# Altium project hub.PrjPCB
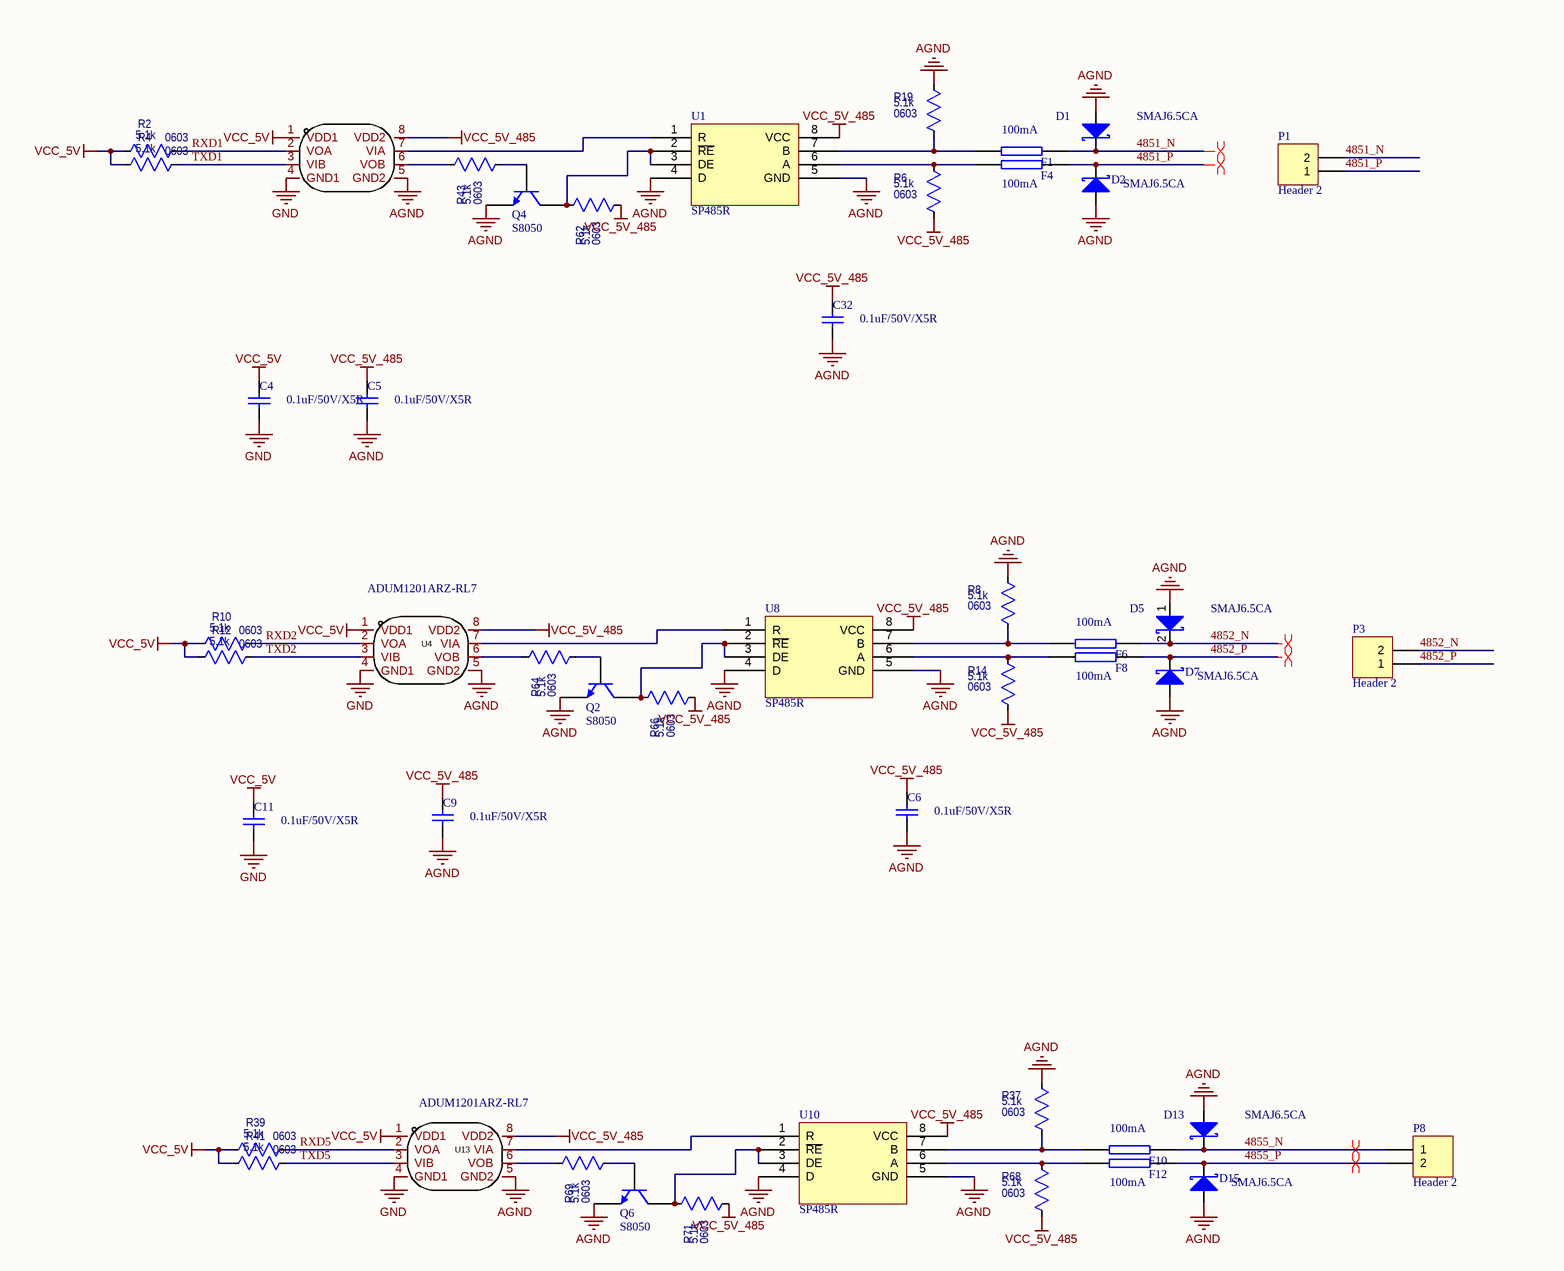
[diagram p0: rs485.SchDoc, top left]
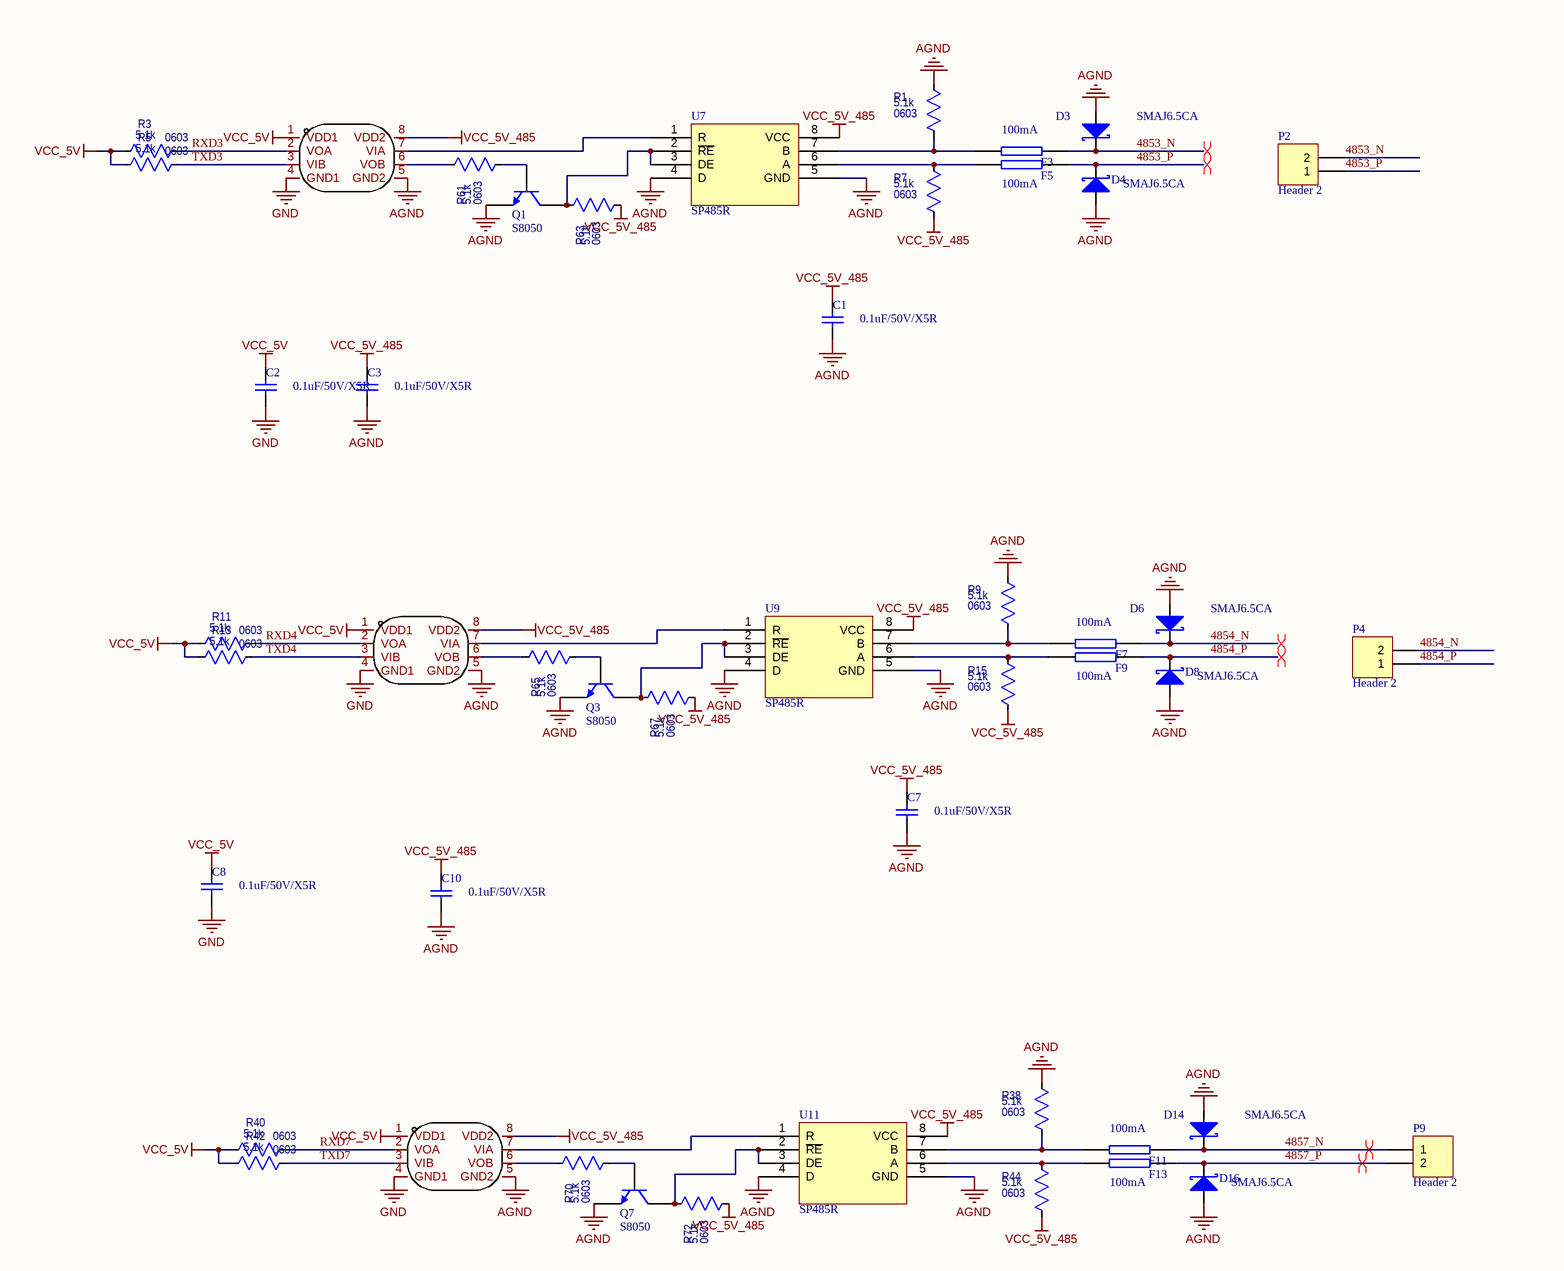
[diagram p1: rs485.SchDoc, top right]
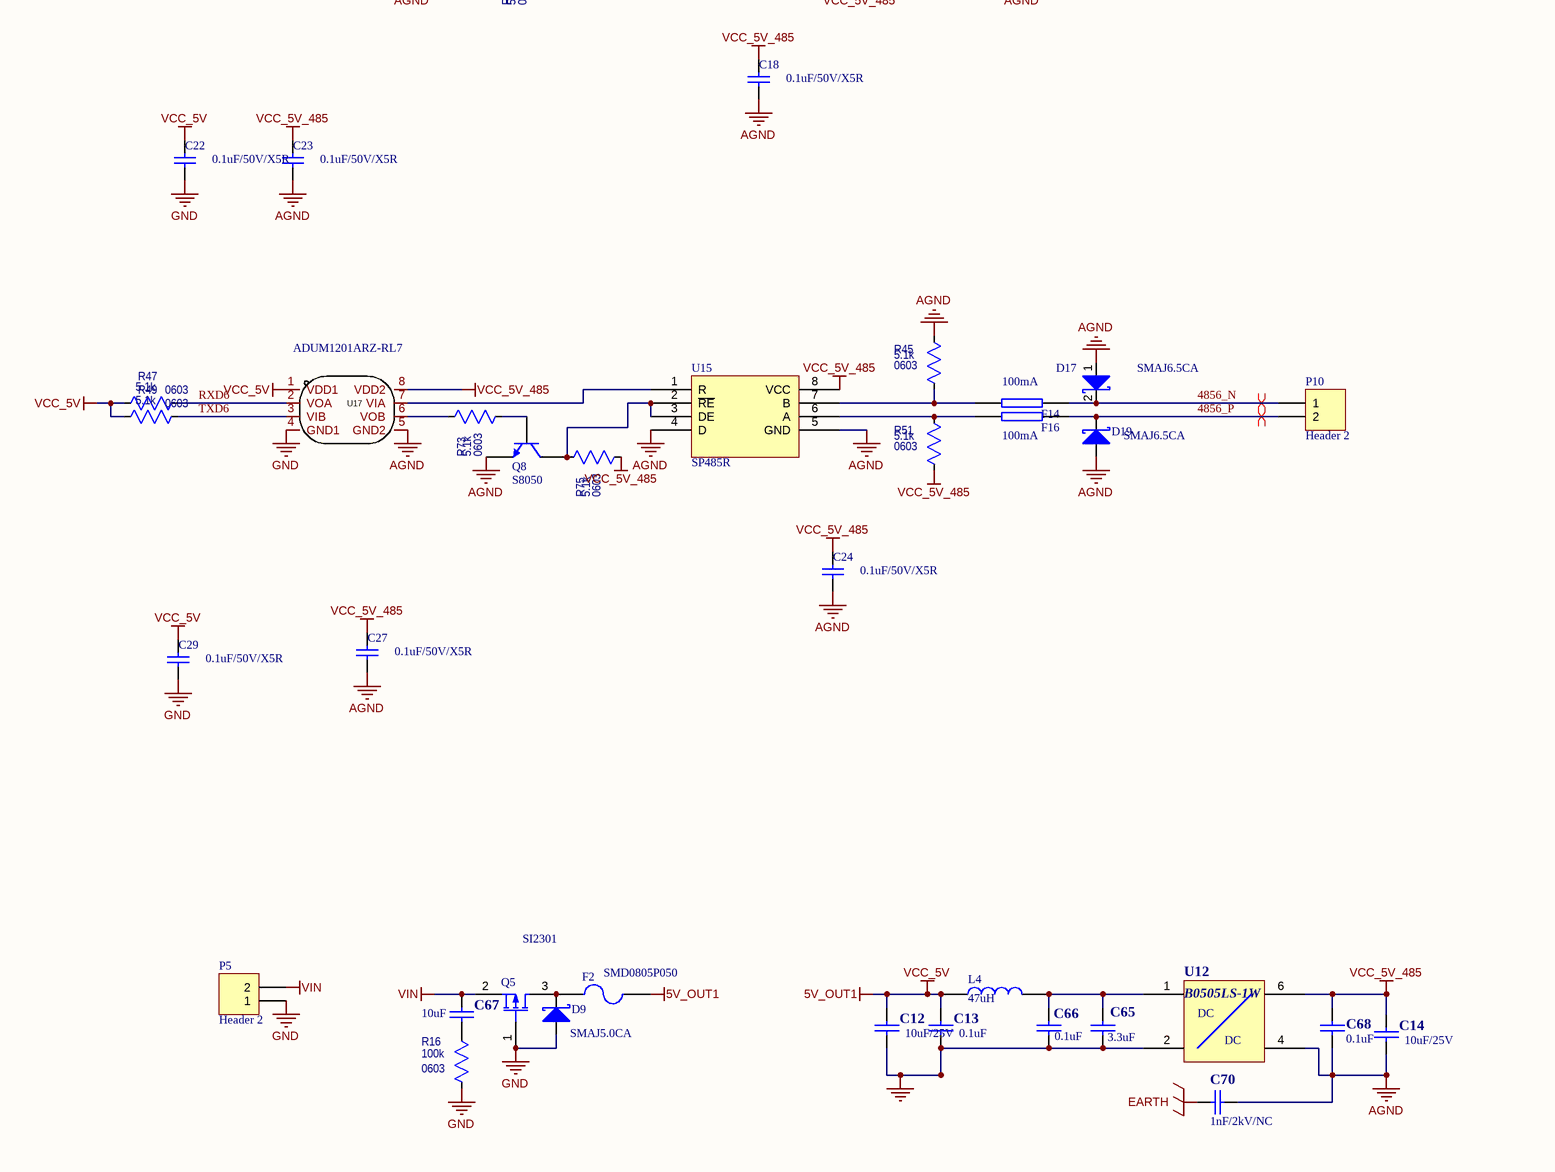
[diagram p2: rs485.SchDoc, bottom left]
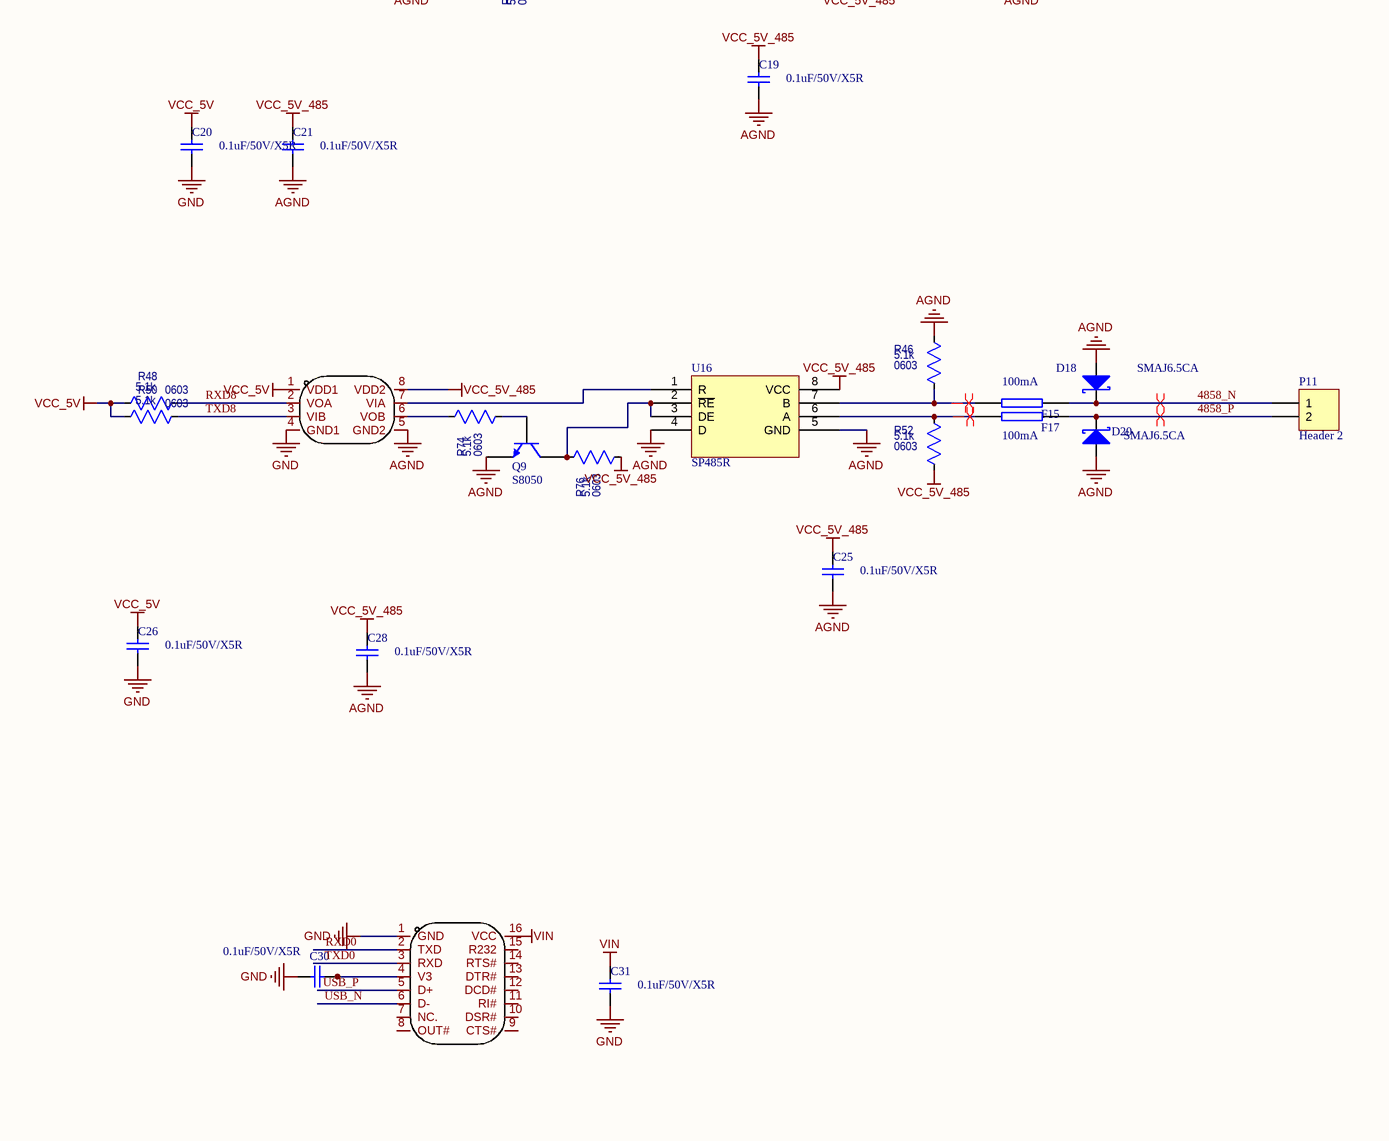
[diagram p3: rs485.SchDoc, bottom right]
2 sheets, 203 parts. Net scope: global (net labels, ports and power ports of the same name join across sheets).
Board file: PCB2.PcbDoc
Sheets:
  rs485.SchDoc
  Sheet2.SchDoc

## Sheet rs485.SchDoc
size D

### Parts
C1  0.1uF/50V/X5R  [0603C]
C2  0.1uF/50V/X5R  [0603C]
C3  0.1uF/50V/X5R  [0603C]
C4  0.1uF/50V/X5R  [0603C]
C5  0.1uF/50V/X5R  [0603C]
C6  0.1uF/50V/X5R  [0603C]
C7  0.1uF/50V/X5R  [0603C]
C8  0.1uF/50V/X5R  [0603C]
C9  0.1uF/50V/X5R  [0603C]
C10  0.1uF/50V/X5R  [0603C]
C11  0.1uF/50V/X5R  [0603C]
C12  10uF/25V  [0805C]
C13  0.1uF  [0603C]
C14  10uF/25V  [0805C]
C18  0.1uF/50V/X5R  [0603C]
C19  0.1uF/50V/X5R  [0603C]
C20  0.1uF/50V/X5R  [0603C]
C21  0.1uF/50V/X5R  [0603C]
C22  0.1uF/50V/X5R  [0603C]
C23  0.1uF/50V/X5R  [0603C]
C24  0.1uF/50V/X5R  [0603C]
C25  0.1uF/50V/X5R  [0603C]
C26  0.1uF/50V/X5R  [0603C]
C27  0.1uF/50V/X5R  [0603C]
C28  0.1uF/50V/X5R  [0603C]
C29  0.1uF/50V/X5R  [0603C]
C30  0.1uF/50V/X5R  [0603C]
C31  0.1uF/50V/X5R  [0603C]
C32  0.1uF/50V/X5R  [0603C]
C65  3.3uF  [0805C]
C66  0.1uF  [0603C]
C67  10uF  [0603C]
C68  0.1uF  [0603C]
C70  1nF/2kV/NC  [1206C]
D1  SMAJ6.5CA  [SMA]
D2  SMAJ6.5CA  [SMA]
D3  SMAJ6.5CA  [SMA]
D4  SMAJ6.5CA  [SMA]
D5  SMAJ6.5CA  [SMA]
D6  SMAJ6.5CA  [SMA]
D7  SMAJ6.5CA  [SMA]
D8  SMAJ6.5CA  [SMA]
D9  SMAJ5.0CA  [SMA]
D13  SMAJ6.5CA  [SMA]
D14  SMAJ6.5CA  [SMA]
D15  SMAJ6.5CA  [SMA]
D16  SMAJ6.5CA  [SMA]
D17  SMAJ6.5CA  [SMA]
D18  SMAJ6.5CA  [SMA]
D19  SMAJ6.5CA  [SMA]
D20  SMAJ6.5CA  [SMA]
F1  100mA  [0805R]
F2  SMD0805P050  [0805R]
F3  100mA  [0805R]
F4  100mA  [0805R]
F5  100mA  [0805R]
F6  100mA  [0805R]
F7  100mA  [0805R]
F8  100mA  [0805R]
F9  100mA  [0805R]
F10  100mA  [0805R]
F11  100mA  [0805R]
F12  100mA  [0805R]
F13  100mA  [0805R]
F14  100mA  [0805R]
F15  100mA  [0805R]
F16  100mA  [0805R]
F17  100mA  [0805R]
L4  47uH  [IND-SMD_L7.0-W6.6_FXL0630]
P1  Header 2  [HDR1X2]
P2  Header 2  [HDR1X2]
P3  Header 2  [HDR1X2]
P4  Header 2  [HDR1X2]
P5  Header 2  [HDR1X2]
P8  Header 2  [HDR1X2]
P9  Header 2  [HDR1X2]
P10  Header 2  [HDR1X2]
P11  Header 2  [HDR1X2]
Q1  S8050  [SOT23-3]
Q2  S8050  [SOT23-3]
Q3  S8050  [SOT23-3]
Q4  S8050  [SOT23-3]
Q5  SI2301  [sot23-3]
Q6  S8050  [SOT23-3]
Q7  S8050  [SOT23-3]
Q8  S8050  [SOT23-3]
Q9  S8050  [SOT23-3]
R1  value 5.1k  Package: 0603  [0603r]  (hidden comment: 10k)
R2  value 5.1k  Package: 0603  [0603r]  (hidden comment: 10k)
R3  value 5.1k  Package: 0603  [0603r]  (hidden comment: 10k)
R4  value 5.1k  Package: 0603  [0603r]  (hidden comment: 10k)
R5  value 5.1k  Package: 0603  [0603r]  (hidden comment: 10k)
R6  value 5.1k  Package: 0603  [0603r]  (hidden comment: 10k)
R7  value 5.1k  Package: 0603  [0603r]  (hidden comment: 10k)
R8  value 5.1k  Package: 0603  [0603r]  (hidden comment: 10k)
R9  value 5.1k  Package: 0603  [0603r]  (hidden comment: 10k)
R10  value 5.1k  Package: 0603  [0603r]  (hidden comment: 10k)
R11  value 5.1k  Package: 0603  [0603r]  (hidden comment: 10k)
R12  value 5.1k  Package: 0603  [0603r]  (hidden comment: 10k)
R13  value 5.1k  Package: 0603  [0603r]  (hidden comment: 10k)
R14  value 5.1k  Package: 0603  [0603r]  (hidden comment: 10k)
R15  value 5.1k  Package: 0603  [0603r]  (hidden comment: 10k)
R16  value 100k  Package: 0603  [0603r]  (hidden comment: 10k)
R19  value 5.1k  Package: 0603  [0603r]  (hidden comment: 10k)
R37  value 5.1k  Package: 0603  [0603r]  (hidden comment: 10k)
R38  value 5.1k  Package: 0603  [0603r]  (hidden comment: 10k)
R39  value 5.1k  Package: 0603  [0603r]  (hidden comment: 10k)
R40  value 5.1k  Package: 0603  [0603r]  (hidden comment: 10k)
R41  value 5.1k  Package: 0603  [0603r]  (hidden comment: 10k)
R42  value 5.1k  Package: 0603  [0603r]  (hidden comment: 10k)
R43  value 5.1k  Package: 0603  [0603r]  (hidden comment: 10k)
R44  value 5.1k  Package: 0603  [0603r]  (hidden comment: 10k)
R45  value 5.1k  Package: 0603  [0603r]  (hidden comment: 10k)
R46  value 5.1k  Package: 0603  [0603r]  (hidden comment: 10k)
R47  value 5.1k  Package: 0603  [0603r]  (hidden comment: 10k)
R48  value 5.1k  Package: 0603  [0603r]  (hidden comment: 10k)
R49  value 5.1k  Package: 0603  [0603r]  (hidden comment: 10k)
R50  value 5.1k  Package: 0603  [0603r]  (hidden comment: 10k)
R51  value 5.1k  Package: 0603  [0603r]  (hidden comment: 10k)
R52  value 5.1k  Package: 0603  [0603r]  (hidden comment: 10k)
R61  value 5.1k  Package: 0603  [0603r]  (hidden comment: 10k)
R62  value 5.1k  Package: 0603  [0603r]  (hidden comment: 10k)
R63  value 5.1k  Package: 0603  [0603r]  (hidden comment: 10k)
R64  value 5.1k  Package: 0603  [0603r]  (hidden comment: 10k)
R65  value 5.1k  Package: 0603  [0603r]  (hidden comment: 10k)
R66  value 5.1k  Package: 0603  [0603r]  (hidden comment: 10k)
R67  value 5.1k  Package: 0603  [0603r]  (hidden comment: 10k)
R68  value 5.1k  Package: 0603  [0603r]  (hidden comment: 10k)
R69  value 5.1k  Package: 0603  [0603r]  (hidden comment: 10k)
R70  value 5.1k  Package: 0603  [0603r]  (hidden comment: 10k)
R71  value 5.1k  Package: 0603  [0603r]  (hidden comment: 10k)
R72  value 5.1k  Package: 0603  [0603r]  (hidden comment: 10k)
R73  value 5.1k  Package: 0603  [0603r]  (hidden comment: 10k)
R74  value 5.1k  Package: 0603  [0603r]  (hidden comment: 10k)
R75  value 5.1k  Package: 0603  [0603r]  (hidden comment: 10k)
R76  value 5.1k  Package: 0603  [0603r]  (hidden comment: 10k)
U1  SP485R  [so-8]
U2  ADUM1201ARZ-RL7  [SO8]  (value not drawn)
U3  ADUM1201ARZ-RL7  [SO-8]  (value not drawn)
U4  ADUM1201ARZ-RL7  [SO-8]
U5  ADUM1201ARZ-RL7  [SO-8]  (value not drawn)
U7  SP485R  [so-8]
U8  SP485R  [so-8]
U9  SP485R  [so-8]
U10  SP485R  [so-8]
U11  SP485R  [so-8]
U12  B0505LS-1W  [PWRM-TH_4P-L19.7-W6.0-P2.54]
U13  ADUM1201ARZ-RL7  [SO-8]
U14  ADUM1201ARZ-RL7  [SO-8]  (value not drawn)
U15  SP485R  [so-8]
U16  SP485R  [so-8]
U17  ADUM1201ARZ-RL7  [SO-8]
U18  ADUM1201ARZ-RL7  [SO-8]  (value not drawn)
U19  CH340C  [SOP-16_L10.0-W3.9-P1.27-LS6.0-BL]  (value not drawn)

### Nets
5V_OUT1: C2.2 C4.2 C8.2 C11.2 C12.1 C13.1 C20.2 C22.2 C26.2 C29.2 F2.2 L4.1 R2.1 R3.1 R4.1 R5.1 R10.1 R11.1 R12.1 R13.1 R39.1 R40.1 R41.1 R42.1 R47.1 R48.1 R49.1 R50.1 U2.1(VDD1) U3.1(VDD1) U4.1(VDD1) U5.1(VDD1) U13.1(VDD1) U14.1(VDD1) U17.1(VDD1) U18.1(VDD1)  [also labelled VCC_5V]
AGND: C1.1 C3.1 C5.1 C6.1 C7.1 C9.1 C10.1 C14.2 C18.1 C19.1 C21.1 C23.1 C24.1 C25.1 C27.1 C28.1 C32.1 C68.2 C70.1 D1.1(A) D2.1(A) D3.1(A) D4.1(A) D5.1(A) D6.1(A) D7.1(A) D8.1(A) D13.1(A) D14.1(A) D15.1(A) D16.1(A) D17.1(A) D18.1(A) D19.1(A) D20.1(A) Q1.2(E) Q2.2(E) Q3.2(E) Q4.2(E) Q6.2(E) Q7.2(E) Q8.2(E) Q9.2(E) R1.1 R8.1 R9.1 R19.1 R37.1 R38.1 R45.1 R46.1 U1.4(D) U1.5(GND) U2.5(GND2) U3.5(GND2) U4.5(GND2) U5.5(GND2) U7.4(D) U7.5(GND) U8.4(D) U8.5(GND) U9.4(D) U9.5(GND) U10.4(D) U10.5(GND) U11.4(D) U11.5(GND) U12.4 U13.5(GND2) U14.5(GND2) U15.4(D) U15.5(GND) U16.4(D) U16.5(GND) U17.5(GND2) U18.5(GND2)
EARTH: C70.2
GND: C2.1 C4.1 C8.1 C11.1 C12.2 C13.2 C20.1 C22.1 C26.1 C29.1 C30.2 C31.1 C65.2 C66.2 D9.1(A) P5.1 Q5.1(G) R16.2 U2.4(GND1) U3.4(GND1) U4.4(GND1) U5.4(GND1) U12.2 U13.4(GND1) U14.4(GND1) U17.4(GND1) U18.4(GND1) U19.1(GND)
VCC_5V_485: C1.2 C3.2 C5.2 C6.2 C7.2 C9.2 C10.2 C14.1 C18.2 C19.2 C21.2 C23.2 C24.2 C25.2 C27.2 C28.2 C32.2 C68.1 R6.2 R7.2 R14.2 R15.2 R44.2 R51.2 R52.2 R62.2 R63.2 R66.2 R67.2 R68.2 R71.2 R72.2 R75.2 R76.2 U1.8(VCC) U2.8(VDD2) U3.8(VDD2) U4.8(VDD2) U5.8(VDD2) U7.8(VCC) U8.8(VCC) U9.8(VCC) U10.8(VCC) U11.8(VCC) U12.6 U13.8(VDD2) U14.8(VDD2) U15.8(VCC) U16.8(VCC) U17.8(VDD2) U18.8(VDD2)
VIN: C31.2 C67.1 P5.2 Q5.2(S) U19.16(VCC)
4851_N: D1.2(K) F1.1 P1.2
4851_P: D2.2(K) F4.1 P1.1
4852_N: D5.2(K) F6.1 P3.2
4852_P: D7.2(K) F8.1 P3.1
4853_N: D3.2(K) F3.1 P2.2
4853_P: D4.2(K) F5.1 P2.1
4854_N: D6.2(K) F7.1 P4.2
4854_P: D8.2(K) F9.1 P4.1
4855_N: D13.2(K) F10.1 P8.1
4855_P: D15.2(K) F12.1 P8.2
4856_N: D17.2(K) F14.1 P10.1
4856_P: D19.2(K) F16.1 P10.2
4857_N: D14.2(K) F11.1 P9.1
4857_P: D16.2(K) F13.1 P9.2
4858_N: D18.2(K) F15.1 P11.1
4858_P: D20.2(K) F17.1 P11.2
RXD0: U19.2(TXD)
RXD1: R2.2 U2.2(VOA)
RXD2: R10.2 U4.2(VOA)
RXD3: R3.2 U3.2(VOA)
RXD4: R11.2 U5.2(VOA)
RXD5: R39.2 U13.2(VOA)
RXD6: R47.2 U17.2(VOA)
RXD7: R40.2 U14.2(VOA)
RXD8: R48.2 U18.2(VOA)
TXD0: U19.3(RXD)
TXD1: R4.2 U2.3(VIB)
TXD2: R12.2 U4.3(VIB)
TXD3: R5.2 U3.3(VIB)
TXD4: R13.2 U5.3(VIB)
TXD5: R41.2 U13.3(VIB)
TXD6: R49.2 U17.3(VIB)
TXD7: R42.2 U14.3(VIB)
TXD8: R50.2 U18.3(VIB)
USB_N: U19.6(D-)
USB_P: U19.5(D+)
NetC30_1: C30.1 U19.4(V3)
NetC65_1: C65.1 C66.1 L4.2 U12.1
NetC67_2: C67.2 R16.1
NetD9_2: D9.2(K) F2.1 Q5.3(D)
NetF1_2: F1.2 R19.2 U1.7(B)
NetF3_2: F3.2 R1.2 U7.7(B)
NetF4_2: F4.2 R6.1 U1.6(A)
NetF5_2: F5.2 R7.1 U7.6(A)
NetF6_2: F6.2 R8.2 U8.7(B)
NetF7_2: F7.2 R9.2 U9.7(B)
NetF8_2: F8.2 R14.1 U8.6(A)
NetF9_2: F9.2 R15.1 U9.6(A)
NetF10_2: F10.2 R37.2 U10.7(B)
NetF11_2: F11.2 R38.2 U11.7(B)
NetF12_2: F12.2 R68.1 U10.6(A)
NetF13_2: F13.2 R44.1 U11.6(A)
NetF14_2: F14.2 R45.2 U15.7(B)
NetF15_2: F15.2 R46.2 U16.7(B)
NetF16_2: F16.2 R51.1 U15.6(A)
NetF17_2: F17.2 R52.1 U16.6(A)
NetQ1_1: Q1.1(B) R61.2
NetQ1_3: Q1.3(C) R63.1 U7.2(~{RE}) U7.3(DE)
NetQ2_1: Q2.1(B) R64.2
NetQ2_3: Q2.3(C) R66.1 U8.2(~{RE}) U8.3(DE)
NetQ3_1: Q3.1(B) R65.2
NetQ3_3: Q3.3(C) R67.1 U9.2(~{RE}) U9.3(DE)
NetQ4_1: Q4.1(B) R43.2
NetQ4_3: Q4.3(C) R62.1 U1.2(~{RE}) U1.3(DE)
NetQ6_1: Q6.1(B) R69.2
NetQ6_3: Q6.3(C) R71.1 U10.2(~{RE}) U10.3(DE)
NetQ7_1: Q7.1(B) R70.2
NetQ7_3: Q7.3(C) R72.1 U11.2(~{RE}) U11.3(DE)
NetQ8_1: Q8.1(B) R73.2
NetQ8_3: Q8.3(C) R75.1 U15.2(~{RE}) U15.3(DE)
NetQ9_1: Q9.1(B) R74.2
NetQ9_3: Q9.3(C) R76.1 U16.2(~{RE}) U16.3(DE)
NetR43_1: R43.1 U2.6(VOB)
NetR61_1: R61.1 U3.6(VOB)
NetR64_1: R64.1 U4.6(VOB)
NetR65_1: R65.1 U5.6(VOB)
NetR69_1: R69.1 U13.6(VOB)
NetR70_1: R70.1 U14.6(VOB)
NetR73_1: R73.1 U17.6(VOB)
NetR74_1: R74.1 U18.6(VOB)
NetU1_1: U1.1(R) U2.7(VIA)
NetU3_7: U3.7(VIA) U7.1(R)
NetU4_7: U4.7(VIA) U8.1(R)
NetU5_7: U5.7(VIA) U9.1(R)
NetU10_1: U10.1(R) U13.7(VIA)
NetU11_1: U11.1(R) U14.7(VIA)
NetU15_1: U15.1(R) U17.7(VIA)
NetU16_1: U16.1(R) U18.7(VIA)

Not connected (* = marked no-connect by the designer): U19 7(NC.) 8(OUT#) 9(CTS#) 10(DSR#) 11(RI#) 12(DCD#) 13(DTR#) 14(RTS#) 15(R232)

### Layout directives
differential pair: 4851_N, 4851_P, 4852_N, 4852_P, 4853_N, 4853_P, 4854_N, 4854_P, 4855_N, 4855_P, 4856_N, 4856_P, 4857_N, 4857_P, 4858_N, 4858_P, NetF15_2, NetF17_2

### Notes on the sheet
- DWG. NO.
- REV.
- SHT.
- REVISION
- DESCRIPTION
- DATE
- APPROVED
- THIS DOCUMENT AND THE DATA DISCLOSED HEREIN OR HEREWITH IS THE PROPERTY OF ALTIUM LIMITED AND MAY BE FREELY DISTRIBUTED IN WHOLE. NO RIGHTS ARE RESERVED OR EXPRESS OR IMPLIED WARANTEE GIVEN.
- ENG:
- DSN:
- APPROVALS
- PROJECT
- DOCUMENT REVISION:
- DESIGN ITEM:
- CHK:
- BOM:
- REFERENCE DOCUMENTS
- PROJECT REVISION:
- TITLE
- FAB DWG:
- PCB DWG:
- ASSY DWG:
- SCALE:
- SIZE
- C
- CAGE CODE
- FILE NAME
- DWG NO.
- SHEET
- OF
- REV
- (in symbol B0505S) DC

### Library data of the parts
C1-C11 C18-C32 = CAP4: 贴片电容 20%
C12-C14 C65-C68 C70 = CAP: Capacitor
D1-D9 D13-D20 = DIODE S: Schottky Diode
F1 F3-F17 = RES2
F2 = Fuse 2: Fuse; Published: 8-Jun-2000; LatestRevisionDate: 17-Jul-2002; LatestRevisionNote: Re-released for DXP Platform.; PackageReference: PIN-W2/E2.8; Publisher: Altium Limited
L4 = INDUCTOR
P1-P5 P8-P11 = Header 2: Header, 2-Pin; LatestRevisionDate: 17-Jul-2002; LatestRevisionNote: Re-released for DXP Platform.; Publisher: Altium Limited
Q1-Q4 Q6-Q9 = NPN: NPN Bipolar Transistor; Published: 8-Jun-2000; LatestRevisionDate: 17-Jul-2002; LatestRevisionNote: Re-released for DXP Platform.; PackageReference: TO-226; Publisher: Altium Limited; Code_JEDEC: TO-226-AA
Q5 = MOSFET-P: P-Channel MOSFET; Published: 8-Jun-2000; LatestRevisionDate: 17-Jul-2002; LatestRevisionNote: Re-released for DXP Platform.; PackageVersion: 1995/1996; PackageReference: E3; Publisher: Altium Limited
R1-R16 R19 R37-R52 R61-R76 = Resistor_0603: PartNumber: RC0603FR-071KL; Power Rating: [power]; TempCo: [tempco]; Tolerance: tol; SupplierDescription: RES SMD 1K OHM 1% 1/10W 0603
U1 U7-U11 U15 U16 = SN65HVD06D
U2-U5 U13 U14 U17 U18 = ADUM1201ARZ-RL7: Add into BOM: yes; Supply Voltage: 2.7V~5.5V; Data Rate: 1Mbps; Number of Channels: 2; Isolation voltage: 2500Vrms; Forward Channel: 1; Symbol: ADUM1201ARZ-RL7; Device: ADUM1201ARZ-RL7; Supplier Part: C9669; Manufacturer Part: ADUM1201ARZ-RL7; Supplier Footprint: SOIC-8; JLCPCB Part Class: Extended Part; Datasheet: https://atta.szlcsc.com/upload/public/pdf/source/20121103/1457706544769.pdf; Supplier: LCSC; Convert to PCB: yes; Reverse channel: 1
U12 = B0505S
U19 = CH340C: Add into BOM: yes; Protocol: USB 2.0; Data Rate: 2Mbps; Symbol: CH340C; Device: CH340C; Supplier: LCSC; Manufacturer Part: CH340C; Supplier Part: C84681; JLCPCB Part Class: Extended Part; Supplier Footprint: SOP-16; Datasheet: https://atta.szlcsc.com/upload/public/pdf/source/20200819/C84681_ADBED554CE321879DBD6B1D06488689C.pdf; Convert to PCB: yes

## Sheet Sheet2.SchDoc
size A3
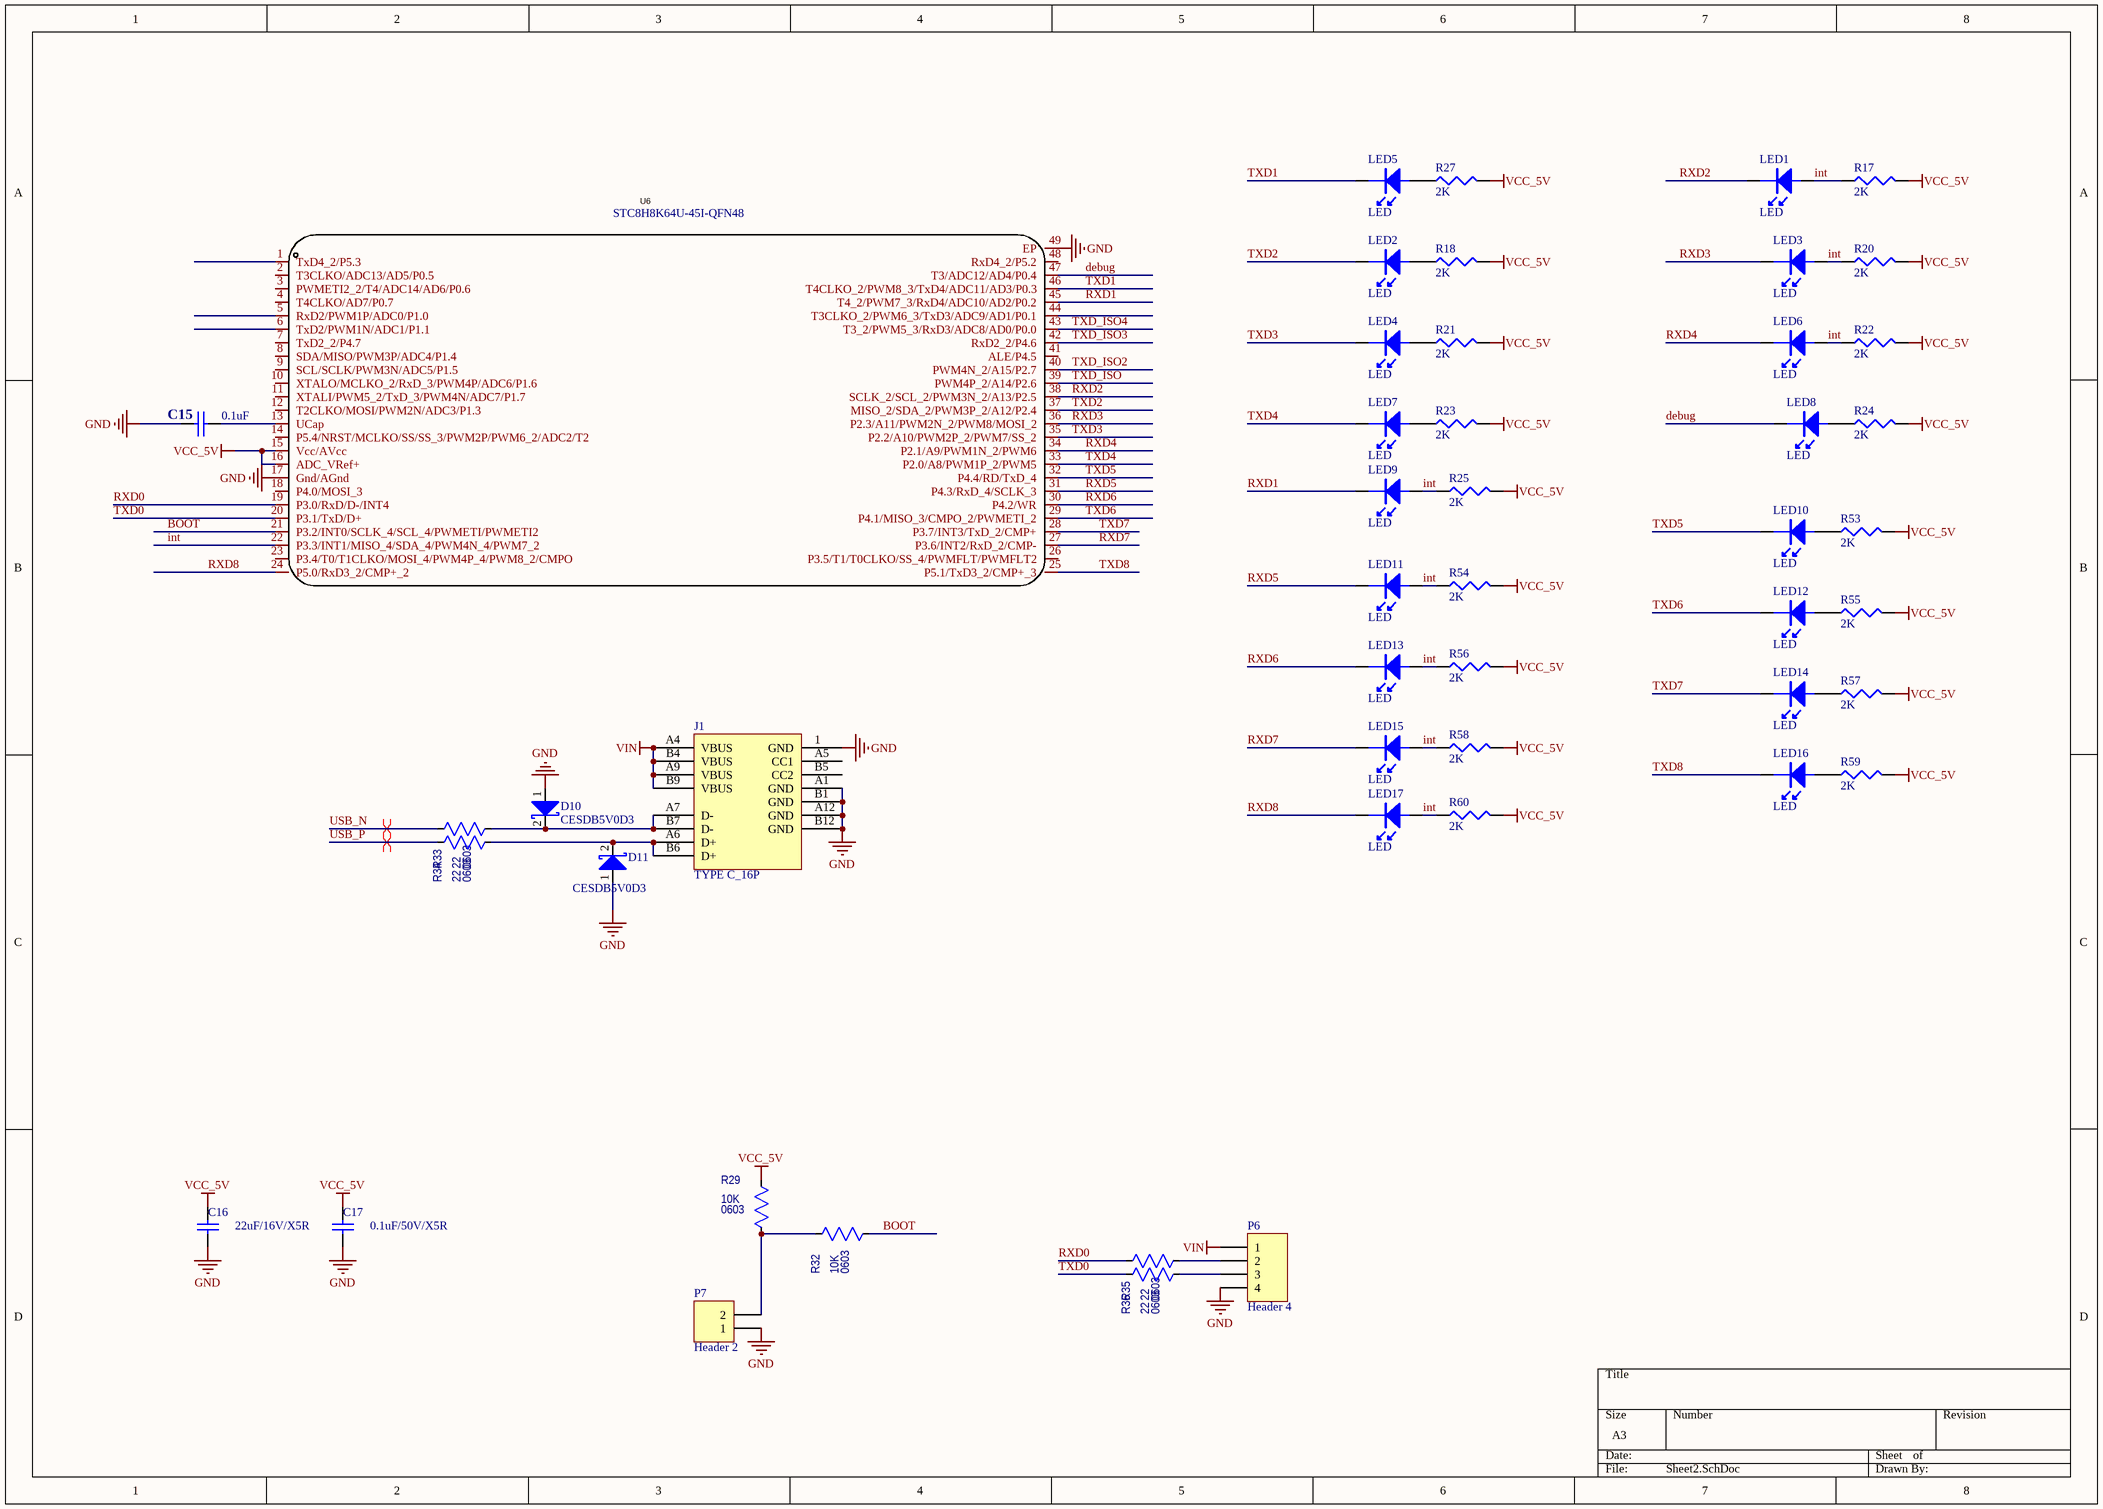
[diagram p4: Sheet2.SchDoc]

### Parts
C15  0.1uF  [0603C]
C16  22uF/16V/X5R  [0805C]
C17  0.1uF/50V/X5R  [0603C]
D10  CESDB5V0D3  [SOD323]
D11  CESDB5V0D3  [SOD323]
J1  TYPE C_16P  [TYPEC_16P]
LED1  LED  [0603LED]
LED2  LED  [0603LED]
LED3  LED  [0603LED]
LED4  LED  [0603LED]
LED5  LED  [0603LED]
LED6  LED  [0603LED]
LED7  LED  [0603LED]
LED8  LED  [0603LED]
LED9  LED  [0603LED]
LED10  LED  [0603LED]
LED11  LED  [0603LED]
LED12  LED  [0603LED]
LED13  LED  [0603LED]
LED14  LED  [0603LED]
LED15  LED  [0603LED]
LED16  LED  [0603LED]
LED17  LED  [0603LED]
P6  Header 4  [HDR1X4]
P7  Header 2  [HDR1X2]
R17  2K  [0603R]
R18  2K  [0603R]
R20  2K  [0603R]
R21  2K  [0603R]
R22  2K  [0603R]
R23  2K  [0603R]
R24  2K  [0603R]
R25  2K  [0603R]
R27  2K  [0603R]
R29  Package: 0603  [0603r]  (hidden comment: 10k)
R32  Package: 0603  [0603r]  (hidden comment: 10k)
R33  value 22  Package: 0603  [0603r]  (hidden comment: 10k)
R34  value 22  Package: 0603  [0603r]  (hidden comment: 10k)
R35  value 22  Package: 0603  [0603r]  (hidden comment: 10k)
R36  value 22  Package: 0603  [0603r]  (hidden comment: 10k)
R53  2K  [0603R]
R54  2K  [0603R]
R55  2K  [0603R]
R56  2K  [0603R]
R57  2K  [0603R]
R58  2K  [0603R]
R59  2K  [0603R]
R60  2K  [0603R]
U6  STC8H8K64U-45I-QFN48  [QFN-48_L6.0-W6.0-P0.40-TL-EP4.4]

### Nets
GND: C15.1 C16.1 C17.1 D10.1(A) D11.1(A) J1.1(GND) J1.A1(GND) J1.A12(GND) J1.B1(GND) J1.B12(GND) P6.4 P7.1 U6.17(Gnd/AGnd) U6.49(EP)
VCC_5V: C16.2 C17.2 R17.2 R18.2 R20.2 R21.2 R22.2 R23.2 R24.2 R25.2 R27.2 R29.1 R53.2 R54.2 R55.2 R56.2 R57.2 R58.2 R59.2 R60.2 U6.15(Vcc/AVcc) U6.16(ADC_VRef+)  [project net 5V_OUT1]
VIN: J1.A4(VBUS) J1.A9(VBUS) J1.B4(VBUS) J1.B9(VBUS) P6.1
BOOT: R32.2 U6.21(P3.2/INT0/SCLK_4/SCL_4/PWMETI/PWMETI2)
debug: LED8.2 U6.47(T3/ADC12/AD4/P0.4)
int: LED1.1 LED3.1 LED6.1 LED9.1 LED11.1 LED13.1 LED15.1 LED17.1 R17.1 R20.1 R22.1 R25.1 R54.1 R56.1 R58.1 R60.1 U6.22(P3.3/INT1/MISO_4/SDA_4/PWM4N_4/PWM7_2)
RXD0: R35.1 U6.19(P3.0/RxD/D-/INT4)
RXD1: LED9.2 U6.45(T4_2/PWM7_3/RxD4/ADC10/AD2/P0.2)
RXD2: LED1.2 U6.38(SCLK_2/SCL_2/PWM3N_2/A13/P2.5)
RXD3: LED3.2 U6.36(P2.3/A11/PWM2N_2/PWM8/MOSI_2)
RXD4: LED6.2 U6.34(P2.1/A9/PWM1N_2/PWM6)
RXD5: LED11.2 U6.31(P4.3/RxD_4/SCLK_3)
RXD6: LED13.2 U6.30(P4.2/WR)
RXD7: LED15.2 U6.27(P3.6/INT2/RxD_2/CMP-)
RXD8: LED17.2 U6.24(P5.0/RxD3_2/CMP+_2)
TXD0: R36.1 U6.20(P3.1/TxD/D+)
TXD1: LED5.2 U6.46(T4CLKO_2/PWM8_3/TxD4/ADC11/AD3/P0.3)
TXD2: LED2.2 U6.37(MISO_2/SDA_2/PWM3P_2/A12/P2.4)
TXD3: LED4.2 U6.35(P2.2/A10/PWM2P_2/PWM7/SS_2)
TXD4: LED7.2 U6.33(P2.0/A8/PWM1P_2/PWM5)
TXD5: LED10.2 U6.32(P4.4/RD/TxD_4)
TXD6: LED12.2 U6.29(P4.1/MISO_3/CMPO_2/PWMETI_2)
TXD7: LED14.2 U6.28(P3.7/INT3/TxD_2/CMP+)
TXD8: LED16.2 U6.25(P5.1/TxD3_2/CMP+_3)
TXD_ISO: U6.39(PWM4P_2/A14/P2.6)
TXD_ISO2: U6.40(PWM4N_2/A15/P2.7)
TXD_ISO3: U6.42(RxD2_2/P4.6)
TXD_ISO4: U6.43(T3_2/PWM5_3/RxD3/ADC8/AD0/P0.0)
USB_N: R33.1
USB_P: R34.1
NetC15_2: C15.2 U6.13(UCap)
NetD10_2: D10.2(K) J1.A7(D-) J1.B7(D-) R33.2
NetD11_2: D11.2(K) J1.A6(D+) J1.B6(D+) R34.2
NetLED2_1: LED2.1 R18.1
NetLED4_1: LED4.1 R21.1
NetLED5_1: LED5.1 R27.1
NetLED7_1: LED7.1 R23.1
NetLED8_1: LED8.1 R24.1
NetLED10_1: LED10.1 R53.1
NetLED12_1: LED12.1 R55.1
NetLED14_1: LED14.1 R57.1
NetLED16_1: LED16.1 R59.1
NetP6_2: P6.2 R35.2
NetP6_3: P6.3 R36.2
NetP7_2: P7.2 R29.2 R32.1

Not connected (* = marked no-connect by the designer): J1 A5(CC1) B5(CC2); U6 1(TxD4_2/P5.3) 2(T3CLKO/ADC13/AD5/P0.5) 3(PWMETI2_2/T4/ADC14/AD6/P0.6) 4(T4CLKO/AD7/P0.7) 5(RxD2/PWM1P/ADC0/P1.0) 6(TxD2/PWM1N/ADC1/P1.1) 7(TxD2_2/P4.7) 8(SDA/MISO/PWM3P/ADC4/P1.4) 9(SCL/SCLK/PWM3N/ADC5/P1.5) 10(XTALO/MCLKO_2/RxD_3/PWM4P/ADC6/P1.6) 11(XTALI/PWM5_2/TxD_3/PWM4N/ADC7/P1.7) 12(T2CLKO/MOSI/PWM2N/ADC3/P1.3) 14(P5.4/NRST/MCLKO/SS/SS_3/PWM2P/PWM6_2/ADC2/T2) 18(P4.0/MOSI_3) 23(P3.4/T0/T1CLKO/MOSI_4/PWM4P_4/PWM8_2/CMPO) 26(P3.5/T1/T0CLKO/SS_4/PWMFLT/PWMFLT2) 41(ALE/P4.5) 44(T3CLKO_2/PWM6_3/TxD3/ADC9/AD1/P0.1) 48(RxD4_2/P5.2)

### Layout directives
differential pair: USB_N, USB_P

### Library data of the parts
C15 = CAP: Capacitor
C16 C17 = CAP4: 贴片电容 20%
D10 D11 = DIODE S: Schottky Diode
P6 = Header 4: Header, 4-Pin; LatestRevisionDate: 17-Jul-2002; LatestRevisionNote: Re-released for DXP Platform.; Publisher: Altium Limited
P7 = Header 2: Header, 2-Pin; LatestRevisionDate: 17-Jul-2002; LatestRevisionNote: Re-released for DXP Platform.; Publisher: Altium Limited
R17 R18 R20-R25 R27 R53-R60 = RES1: P: 1/8W
R29 R32-R36 = Resistor_0603: as R1 on sheet rs485; SupplierDescription: RES SMD 1K OHM 1% 1/10W 0603
  R29 R32: Value: 10K
U6 = STC8H8K64U-45I-QFN48: Add into BOM: yes; Symbol: STC8H8K64U-45I-QFN48; Device: STC8H8K64U-45I-QFN48; Supplier Part: C5339175; Manufacturer Part: STC8H8K64U-45I-QFN48; Supplier Footprint: QFN-48(6x6); JLCPCB Part Class: Extended Part; Datasheet: https://atta.szlcsc.com/upload/public/pdf/source/20240415/6EBDADF517194314A061D0AE8E2F25D8.pdf; Supplier: LCSC; Convert to PCB: yes

## Nets that join several sheets
5V_OUT1: rs485 (36 pins), Sheet2 (22 pins)
GND: rs485 (28 pins), Sheet2 (14 pins)
VIN: rs485 (5 pins), Sheet2 (5 pins)
RXD0: rs485 (U19.2), Sheet2 (R35.1 U6.19)
RXD1: rs485 (R2.2 U2.2), Sheet2 (LED9.2 U6.45)
RXD2: rs485 (R10.2 U4.2), Sheet2 (LED1.2 U6.38)
RXD3: rs485 (R3.2 U3.2), Sheet2 (LED3.2 U6.36)
RXD4: rs485 (R11.2 U5.2), Sheet2 (LED6.2 U6.34)
RXD5: rs485 (R39.2 U13.2), Sheet2 (LED11.2 U6.31)
RXD6: rs485 (R47.2 U17.2), Sheet2 (LED13.2 U6.30)
RXD7: rs485 (R40.2 U14.2), Sheet2 (LED15.2 U6.27)
RXD8: rs485 (R48.2 U18.2), Sheet2 (LED17.2 U6.24)
TXD0: rs485 (U19.3), Sheet2 (R36.1 U6.20)
TXD1: rs485 (R4.2 U2.3), Sheet2 (LED5.2 U6.46)
TXD2: rs485 (R12.2 U4.3), Sheet2 (LED2.2 U6.37)
TXD3: rs485 (R5.2 U3.3), Sheet2 (LED4.2 U6.35)
TXD4: rs485 (R13.2 U5.3), Sheet2 (LED7.2 U6.33)
TXD5: rs485 (R41.2 U13.3), Sheet2 (LED10.2 U6.32)
TXD6: rs485 (R49.2 U17.3), Sheet2 (LED12.2 U6.29)
TXD7: rs485 (R42.2 U14.3), Sheet2 (LED14.2 U6.28)
TXD8: rs485 (R50.2 U18.3), Sheet2 (LED16.2 U6.25)
USB_N: rs485 (U19.6), Sheet2 (R33.1)
USB_P: rs485 (U19.5), Sheet2 (R34.1)